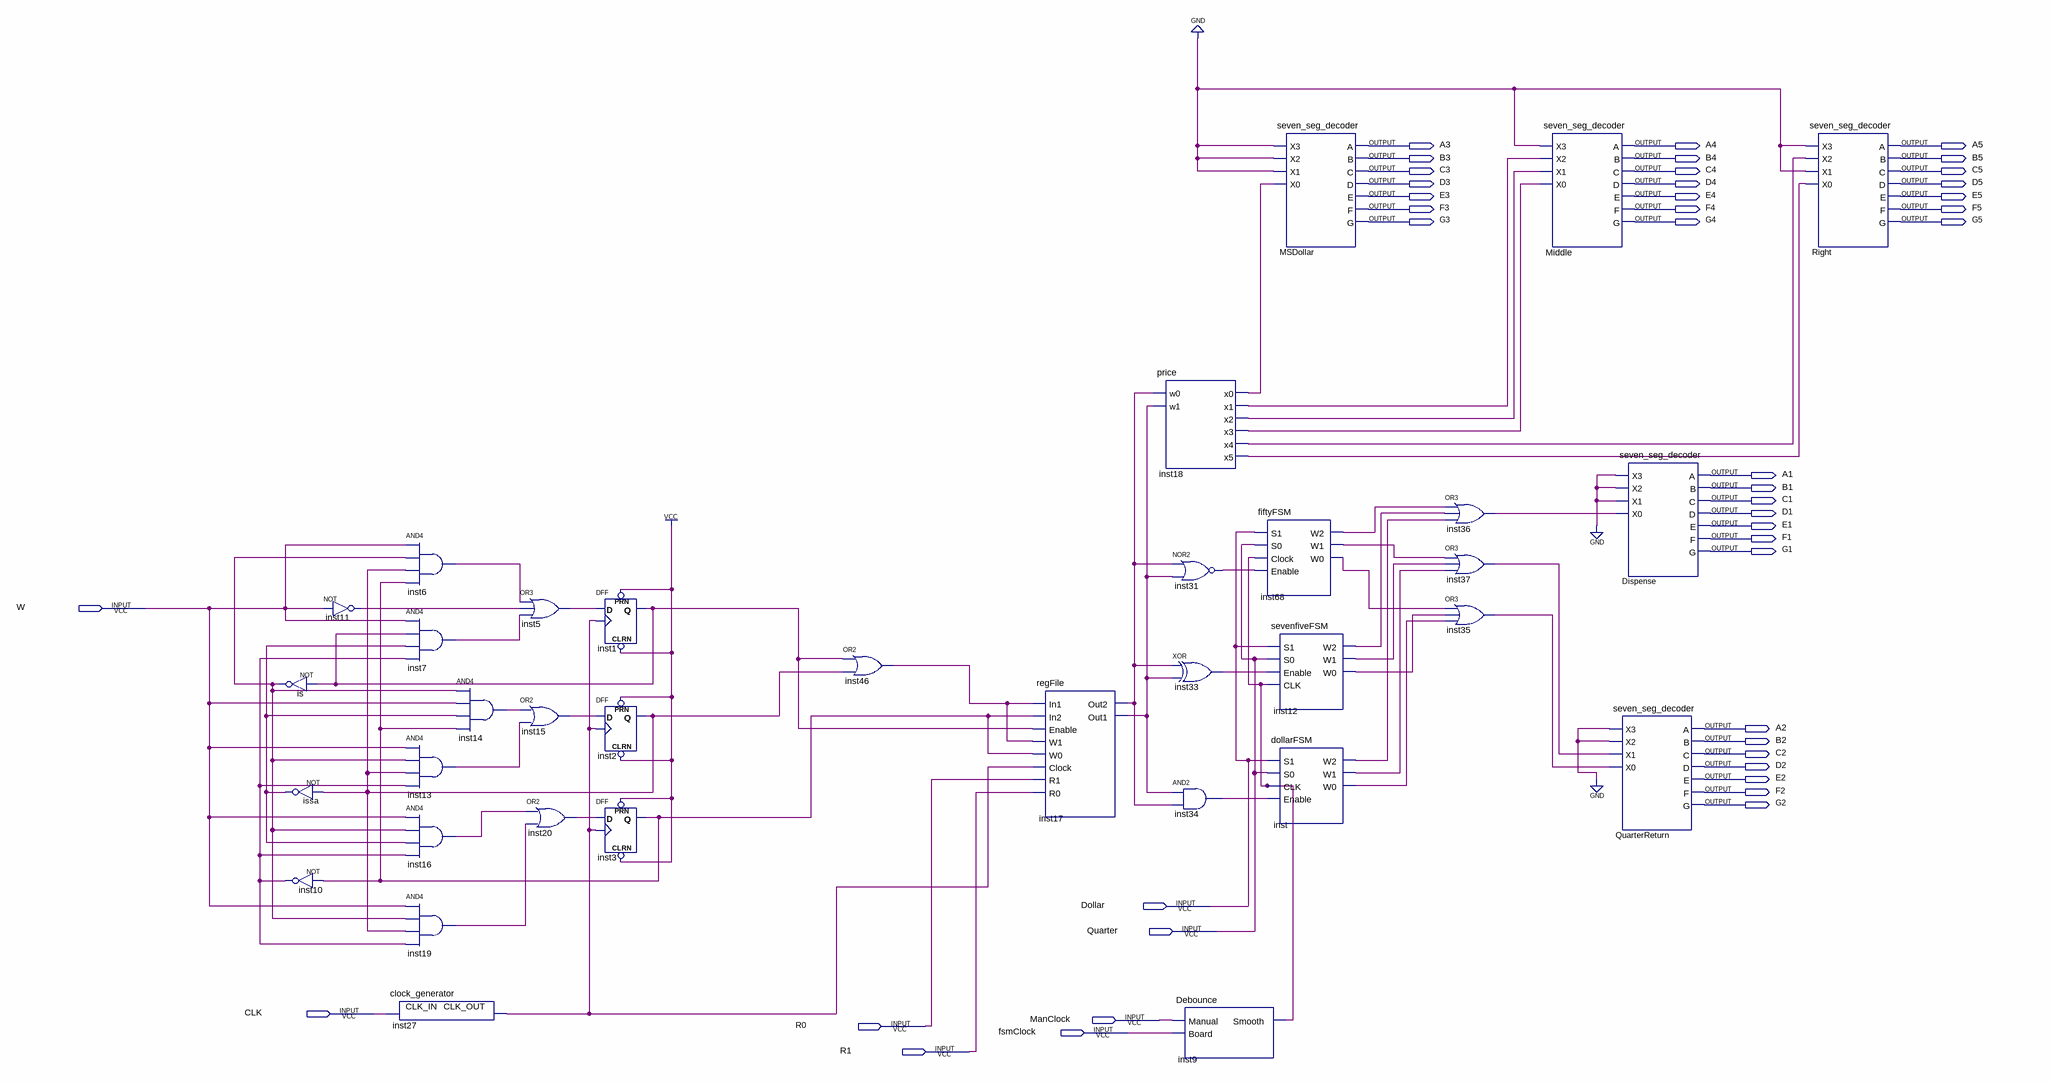
[diagram p0: schematic sheet]
// Quartus schematic totalProj.bdf as structural Verilog: 35 symbols, 43 pins
module totalProj (
  input  W,
  input  Dollar,
  input  Quarter,
  input  CLK,
  input  ManClock,
  input  R0,
  input  fsmClock,
  input  R1,
  output A3,
  output A4,
  output A5,
  output B3,
  output B4,
  output B5,
  output C3,
  output C4,
  output C5,
  output D3,
  output D4,
  output D5,
  output E3,
  output E4,
  output E5,
  output F3,
  output F4,
  output F5,
  output G3,
  output G4,
  output G5,
  output A1,
  output B1,
  output C1,
  output D1,
  output E1,
  output F1,
  output G1,
  output A2,
  output B2,
  output C2,
  output D2,
  output E2,
  output F2,
  output G2
);

  wire inst1_q, inst2_q, inst3_q, inst5_out, inst6_out, inst7_out, inst9_smooth, inst10_out, inst11_out,
       inst12_w0, inst12_w1, inst12_w2, inst13_out, inst14_out, inst15_out, inst16_out, inst17_out1,
       inst17_out2, inst18_x0, inst18_x1, inst18_x2, inst18_x3, inst18_x4, inst18_x5, inst19_out, inst20_out,
       inst27_clk_out, inst31_out, inst33_out, inst34_out, inst35_out, inst36_out, inst37_out, inst46_out,
       inst68_w0, inst68_w1, inst68_w2, inst_w0, inst_w1, inst_w2, is_out, issa_out;

  not is (is_out, inst1_q);
  not issa (issa_out, inst2_q);
  not inst10 (inst10_out, inst3_q);
  not inst11 (inst11_out, W);
  and inst6 (inst6_out, W, is_out, inst2_q, inst3_q);
  and inst7 (inst7_out, W, inst1_q, issa_out, inst10_out);
  and inst13 (inst13_out, W, is_out, inst2_q, inst10_out);
  and inst16 (inst16_out, W, is_out, issa_out, inst10_out);
  and inst19 (inst19_out, W, is_out, inst2_q, inst10_out);
  clock_generator inst27 (.CLK_IN(CLK), .CLK_OUT(inst27_clk_out));
  and inst14 (inst14_out, is_out, W, issa_out, inst3_q);
  or inst5 (inst5_out, inst6_out, inst11_out, inst7_out);
  or inst15 (inst15_out, inst14_out, inst13_out);
  or inst20 (inst20_out, inst16_out, inst19_out);
  DFF inst1 (.CLRN(1'b1), .CLK(inst27_clk_out), .D(inst5_out), .PRN(1'b1), .Q(inst1_q));
  DFF inst2 (.CLRN(1'b1), .CLK(inst27_clk_out), .D(inst15_out), .PRN(1'b1), .Q(inst2_q));
  DFF inst3 (.CLRN(1'b1), .CLK(inst27_clk_out), .D(inst20_out), .PRN(1'b1), .Q(inst3_q));
  or inst46 (inst46_out, inst1_q, inst2_q);
  regFile inst17 (
    .In1(inst46_out), .In2(inst3_q), .Enable(inst1_q), .W1(inst46_out), .W0(inst3_q), .Clock(inst27_clk_out),
    .R1(R0), .R0(R1), .Out2(inst17_out2), .Out1(inst17_out1));
  price inst18 (
    .w0(inst17_out2), .w1(inst17_out1), .x0(inst18_x0), .x1(inst18_x1), .x2(inst18_x2), .x3(inst18_x3),
    .x4(inst18_x4), .x5(inst18_x5));
  nor inst31 (inst31_out, inst17_out2, inst17_out1);
  xor inst33 (inst33_out, inst17_out2, inst17_out1);
  and inst34 (inst34_out, inst17_out1, inst17_out2);
  Debounce inst9 (.Manual(ManClock), .Board(fsmClock), .Smooth(inst9_smooth));
  fiftyFSM inst68 (
    .S1(Dollar), .S0(Quarter), .Clock(inst9_smooth), .Enable(inst31_out), .W2(inst68_w2), .W1(inst68_w1),
    .W0(inst68_w0));
  sevenfiveFSM inst12 (
    .S1(Dollar), .S0(Quarter), .Enable(inst33_out), .CLK(inst9_smooth), .W2(inst12_w2), .W1(inst12_w1),
    .W0(inst12_w0));
  dollarFSM inst (
    .S1(Dollar), .S0(Quarter), .CLK(inst9_smooth), .Enable(inst34_out), .W2(inst_w2), .W1(inst_w1),
    .W0(inst_w0));
  seven_seg_decoder MSDollar (
    .X3(1'b0), .X2(1'b0), .X1(1'b0), .X0(inst18_x0), .A(A3), .B(B3), .C(C3), .D(D3), .E(E3), .F(F3), .G(G3));
  or inst36 (inst36_out, inst68_w2, inst12_w2, inst_w2);
  or inst37 (inst37_out, inst68_w1, inst12_w1, inst_w1);
  or inst35 (inst35_out, inst68_w0, inst12_w0, inst_w0);
  seven_seg_decoder Middle (
    .X3(1'b0), .X2(inst18_x1), .X1(inst18_x2), .X0(inst18_x3), .A(A4), .B(B4), .C(C4), .D(D4), .E(E4),
    .F(F4), .G(G4));
  seven_seg_decoder Dispense (
    .X3(1'b0), .X2(1'b0), .X1(1'b0), .X0(inst36_out), .A(A1), .B(B1), .C(C1), .D(D1), .E(E1), .F(F1), .G(G1));
  seven_seg_decoder QuarterReturn (
    .X3(1'b0), .X2(1'b0), .X1(inst37_out), .X0(inst35_out), .A(A2), .B(B2), .C(C2), .D(D2), .E(E2), .F(F2),
    .G(G2));
  seven_seg_decoder Right (
    .X3(1'b0), .X2(inst18_x4), .X1(1'b0), .X0(inst18_x5), .A(A5), .B(B5), .C(C5), .D(D5), .E(E5), .F(F5),
    .G(G5));
endmodule
